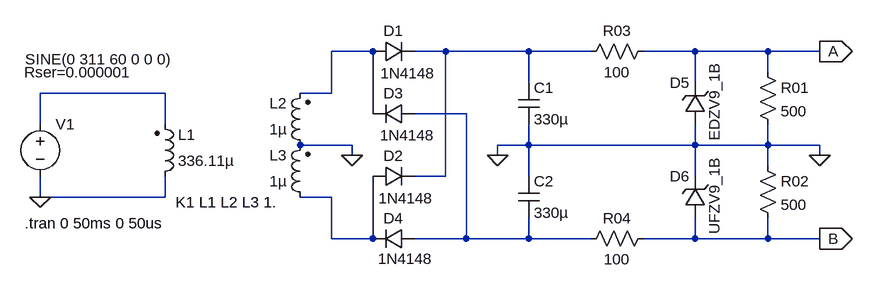
[diagram p0: schematic Fonte Linear.asc]
Fonte Linear.asc, the LTspice schematic file:
Version 4
SHEET 1 1068 680
WIRE 304 64 240 64
WIRE 416 64 368 64
WIRE 544 64 416 64
WIRE 640 64 544 64
WIRE 800 64 720 64
WIRE 912 64 800 64
WIRE 992 64 912 64
WIRE 912 96 912 64
WIRE 544 112 544 64
WIRE 800 112 800 64
WIRE -16 128 -208 128
WIRE 240 128 240 64
WIRE 240 128 192 128
WIRE 304 160 304 64
WIRE 448 160 368 160
WIRE -208 176 -208 128
WIRE -16 176 -16 128
WIRE 272 208 192 208
WIRE 544 208 544 176
WIRE 544 208 496 208
WIRE 800 208 800 176
WIRE 800 208 544 208
WIRE 912 208 912 176
WIRE 912 208 800 208
WIRE 992 208 912 208
WIRE 272 224 272 208
WIRE 496 224 496 208
WIRE 992 224 992 208
WIRE 912 240 912 208
WIRE 416 256 416 64
WIRE 416 256 368 256
WIRE 544 256 544 208
WIRE 800 256 800 208
WIRE -208 288 -208 256
WIRE -16 288 -16 256
WIRE -16 288 -208 288
WIRE 240 288 192 288
WIRE 240 352 240 288
WIRE 304 352 304 256
WIRE 304 352 240 352
WIRE 448 352 448 160
WIRE 448 352 368 352
WIRE 544 352 544 320
WIRE 544 352 448 352
WIRE 640 352 544 352
WIRE 800 352 800 320
WIRE 800 352 720 352
WIRE 912 352 912 320
WIRE 912 352 800 352
WIRE 992 352 912 352
FLAG 272 224 0
FLAG 496 224 0
FLAG 992 224 0
FLAG 992 64 A
IOPIN 992 64 Out
FLAG 992 352 B
IOPIN 992 352 Out
FLAG -208 288 0
SYMBOL ind2 -32 272 M180
WINDOW 0 36 80 Left 2
WINDOW 3 36 40 Left 2
SYMATTR InstName L1
SYMATTR Value 336.11µ
SYMBOL ind2 208 224 R180
WINDOW 0 36 80 Left 2
WINDOW 3 36 40 Left 2
SYMATTR InstName L2
SYMATTR Value 1µ
SYMBOL ind2 208 304 R180
WINDOW 0 36 80 Left 2
WINDOW 3 36 40 Left 2
SYMATTR InstName L3
SYMATTR Value 1µ
SYMBOL voltage -208 160 R0
WINDOW 3 -23 -84 Left 2
WINDOW 123 0 0 Left 0
WINDOW 39 -25 -64 Left 2
SYMATTR Value SINE(0 311 60 0 0 0)
SYMATTR SpiceLine Rser=0.000001
SYMATTR InstName V1
SYMBOL diode 368 144 R90
WINDOW 0 0 32 VBottom 2
WINDOW 3 33 11 VTop 2
SYMATTR InstName D3
SYMATTR Value 1N4148
SYMBOL diode 368 336 R90
WINDOW 0 0 32 VBottom 2
WINDOW 3 31 14 VTop 2
SYMATTR InstName D4
SYMATTR Value 1N4148
SYMBOL diode 304 272 R270
WINDOW 0 32 32 VTop 2
WINDOW 3 -2 51 VBottom 2
SYMATTR InstName D2
SYMATTR Value 1N4148
SYMBOL diode 304 80 R270
WINDOW 0 32 32 VTop 2
WINDOW 3 -2 54 VBottom 2
SYMATTR InstName D1
SYMATTR Value 1N4148
SYMBOL cap 528 112 R0
SYMATTR InstName C1
SYMATTR Value 330µ
SYMBOL cap 528 256 R0
SYMATTR InstName C2
SYMATTR Value 330µ
SYMBOL res 736 48 R90
WINDOW 0 0 56 VBottom 2
WINDOW 3 32 56 VTop 2
SYMATTR InstName R03
SYMATTR Value 100
SYMBOL res 736 336 R90
WINDOW 0 0 56 VBottom 2
WINDOW 3 32 56 VTop 2
SYMATTR InstName R04
SYMATTR Value 100
SYMBOL res 896 80 R0
SYMATTR InstName R01
SYMATTR Value 500
SYMBOL res 896 224 R0
SYMATTR InstName R02
SYMATTR Value 500
SYMBOL zener 816 176 R180
WINDOW 0 24 64 Left 2
WINDOW 3 -14 -25 VRight 2
SYMATTR InstName D5
SYMATTR Value EDZV9_1B
SYMATTR Description Diode
SYMATTR Type diode
SYMBOL zener 816 320 R180
WINDOW 0 24 64 Left 2
WINDOW 3 -14 -25 VRight 2
SYMATTR InstName D6
SYMATTR Value UFZV9_1B
SYMATTR Description Diode
SYMATTR Type diode
TEXT 0 296 Left 2 !K1 L1 L2 L3 1.
TEXT -232 328 Left 2 !.tran 0 50ms 0 50us

The netlist it stands for:
* Fonte Linear.asc
L1 0 N003 336.11µ
L2 0 N001 1µ
L3 N005 0 1µ
V1 N003 0 SINE(0 311 60 0 0 0) Rser=0.000001
D3 N004 N001 1N4148
D4 N004 N005 1N4148
D2 N005 N002 1N4148
D1 N001 N002 1N4148
C1 N002 0 330µ
C2 0 N004 330µ
R03 A N002 100
R04 B N004 100
R01 A 0 500
R02 0 B 500
D5 0 A EDZV9_1B
D6 B 0 UFZV9_1B
.model D D
.lib standard.dio
K1 L1 L2 L3 1.
.tran 0 50ms 0 50us
.backanno
.end